# Altium schematic sheet BackPage.SchDoc: Back Page
size Letter; Engineer: Nathan Petersen; SheetNumber: 3; SheetTotal: 3
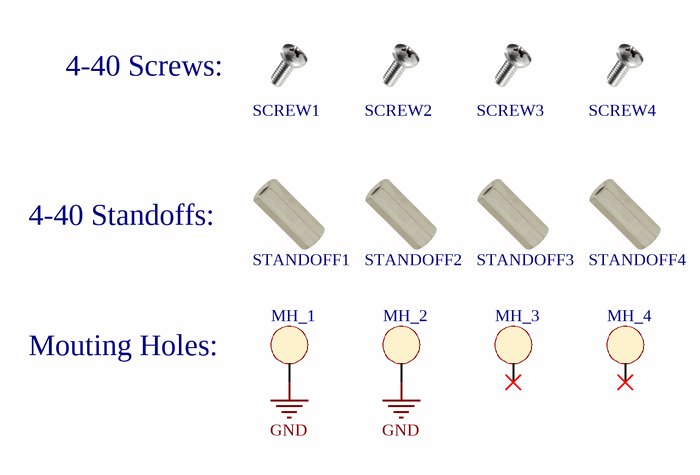
[diagram p0: BackPage.SchDoc]

## Parts
MH_1  MOUNTING_HOLE  [MOUNTING_HOLE]  (value not drawn)  (no BOM)
MH_2  MOUNTING_HOLE  [MOUNTING_HOLE]  (value not drawn)  (no BOM)
MH_3  MOUNTING_HOLE  [MOUNTING_HOLE]  (value not drawn)  (no BOM)
MH_4  MOUNTING_HOLE  [MOUNTING_HOLE]  (value not drawn)  (no BOM)
SCREW1  Screw-4-40  (value not drawn)  (mechanical)
SCREW2  Screw-4-40  (value not drawn)  (mechanical)
SCREW3  Screw-4-40  (value not drawn)  (mechanical)
SCREW4  Screw-4-40  (value not drawn)  (mechanical)
STANDOFF1  Standoff-4-40  (value not drawn)  (mechanical)
STANDOFF2  Standoff-4-40  (value not drawn)  (mechanical)
STANDOFF3  Standoff-4-40  (value not drawn)  (mechanical)
STANDOFF4  Standoff-4-40  (value not drawn)  (mechanical)

## Nets
GND: MH_1.1 MH_2.1

Not connected (* = marked no-connect by the designer): MH_3 1*; MH_4 1*

## Notes on the sheet
- (near SCREW1) 4-40 Screws:
- (near STANDOFF1) 4-40 Standoffs:
- Mouting Holes:
- Title:
- File:
- Sheet:
- of
- Revision:
- Time:
- Date:
- Engineer:

## Library data of the parts
SCREW1-SCREW4 = Screw-4-40: Supplier 1: Digi-Key; Supplier Part Number 1: KEY1046-ND
STANDOFF1-STANDOFF4 = Standoff-4-40: Supplier 1: Digi-Key; Supplier Part Number 1: 36-1656-ND